# Altium project AD9959-PRJ.PrjPcb
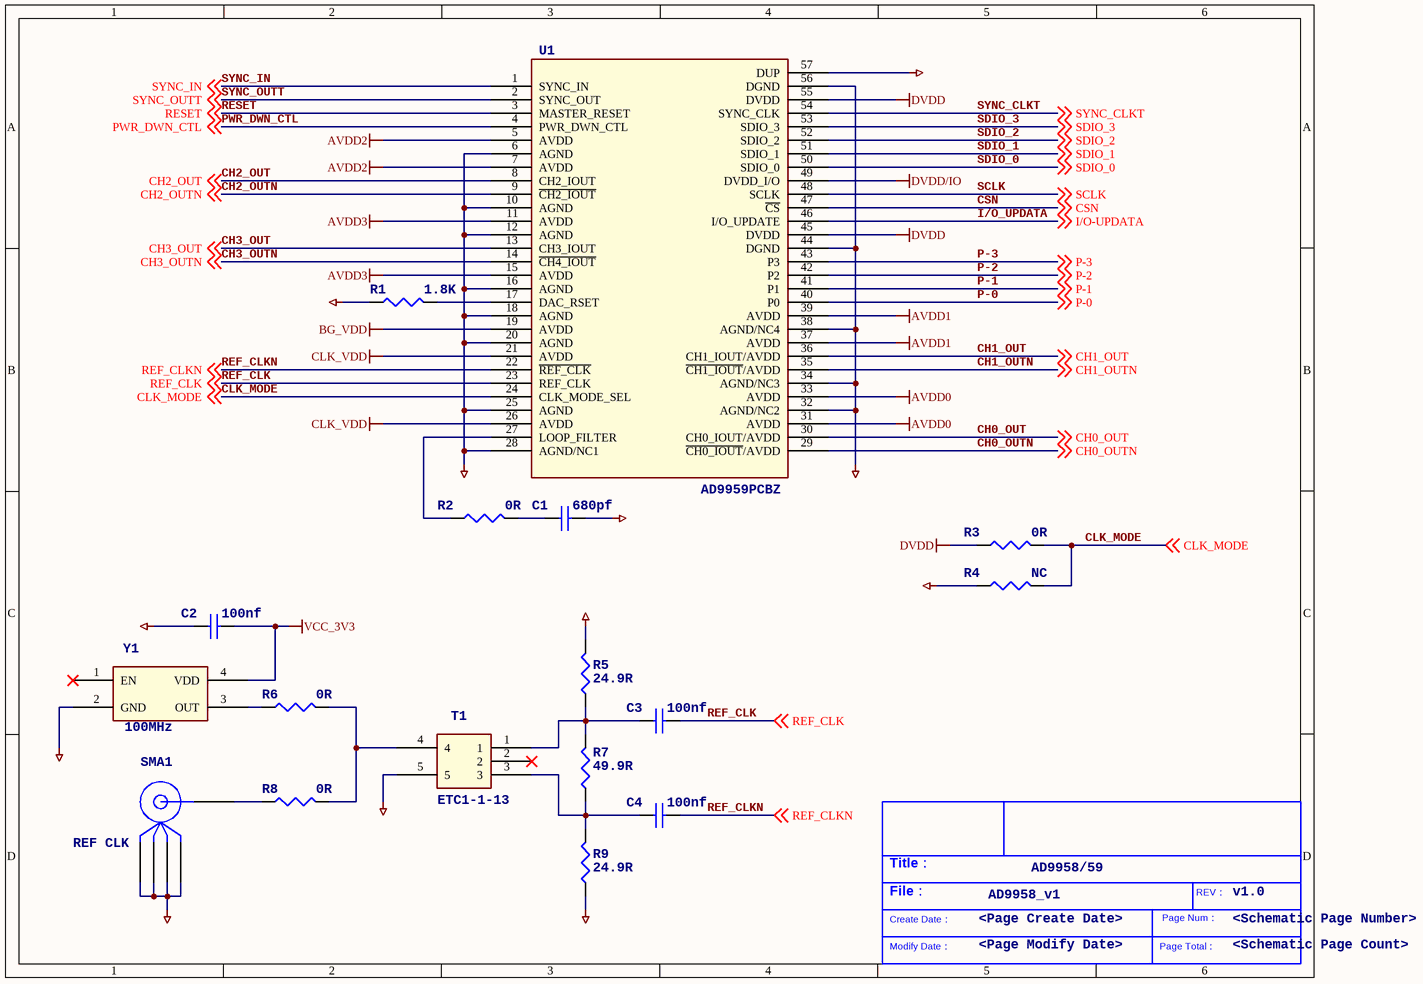
[diagram p0: 01-MCU.SchDoc]
4 sheets, 148 parts. Net scope: global (net labels, ports and power ports of the same name join across sheets).
Board file: AD9959-pcb.PcbDoc
Sheets:
  01-MCU.SchDoc
  02-I_O.SchDoc
  03-LP Filter.SchDoc
  04-POWER.SchDoc

## Sheet 01-MCU.SchDoc
size 246 x 182 mm

### Parts
(Parts that share a designator on the sheet are numbered #1, #2 ... from top to bottom, then left to right.)
*#1  Schematic Page Count: <Schematic Page Count>  Schematic Page Number: <Schematic Page Number>  Page Modify Date: <Page Modify Date>  Page Create Date: <Page Create Date>  Revcode: v1.0  File: AD9958_v1  Title: AD9958/59  (hidden comment: My_Title_Block)  (graphical)
C1  680pf  [0603C]
C2  100nf  [0603C]
C3  100nf  [0603C]
C4  100nf  [0603C]
R1  1.8K  [0603R]
R2  0R  [0603R]
R3  0R  [0603R]
R4  NC  [0603R]
R5  24.9R  [0603R]
R6  0R  [0603R]
R7  49.9R  [0603R]
R8  0R  [0603R]
R9  24.9R  [0603R]
SMA1  REF CLK  [CON10-5R1X5R1]
T1  ETC1-1-13  [SM-22]
U1  AD9959PCBZ  [QFN50P800X800X100-56M]
Y1  100MHz  [XTAL-SMD-7050_4P]

### Nets
AGND: C1.2 C2.1 R1.1 R4.1 R5.2 R9.1 SMA1.2(GND) SMA1.3(GND) SMA1.4(GND) SMA1.5(GND) T1.5 U1.6(AGND) U1.10(AGND) U1.12(AGND) U1.16(AGND) U1.18(AGND) U1.20(AGND) U1.25(AGND) U1.28(AGND/NC1) U1.32(AGND/NC2) U1.34(AGND/NC3) U1.38(AGND/NC4) U1.44(DGND) U1.56(DGND) U1.57(DUP) Y1.2(GND)
AVDD0: U1.31(AVDD) U1.33(AVDD)
AVDD1: U1.37(AVDD) U1.39(AVDD)
AVDD2: U1.5(AVDD) U1.7(AVDD)
AVDD3: U1.11(AVDD) U1.15(AVDD)
BG_VDD: U1.19(AVDD)
CLK_VDD: U1.21(AVDD) U1.26(AVDD)
DVDD: R3.1 U1.45(DVDD) U1.55(DVDD)
DVDD/IO: U1.49(DVDD_I/O)
VCC_3V3: C2.2 Y1.4(VDD)
CH0_OUT: U1.30(CH0_IOUT/AVDD) ; off-sheet CH0_OUT
CH0_OUTN: U1.29(~{CH0_IOUT}/AVDD) ; off-sheet CH0_OUTN
CH1_OUT: U1.36(CH1_IOUT/AVDD) ; off-sheet CH1_OUT
CH1_OUTN: U1.35(~{CH1_IOUT}/AVDD) ; off-sheet CH1_OUTN
CH2_OUT: U1.8(CH2_IOUT) ; off-sheet CH2_OUT
CH2_OUTN: U1.9(~{CH2_IOUT}) ; off-sheet CH2_OUTN
CH3_OUT: U1.13(CH3_IOUT) ; off-sheet CH3_OUT
CH3_OUTN: U1.14(~{CH4_IOUT}) ; off-sheet CH3_OUTN
CLK_MODE: R3.2 R4.2 U1.24(CLK_MODE_SEL) ; off-sheet CLK_MODE
CSN: U1.47(~{CS}) ; off-sheet CSN
I/O-UPDATA: U1.46(I/O_UPDATE) ; off-sheet I/O-UPDATA  [also labelled I/O_UPDATA]
P-0: U1.40(P0) ; off-sheet P-0
P-1: U1.41(P1) ; off-sheet P-1
P-2: U1.42(P2) ; off-sheet P-2
P-3: U1.43(P3) ; off-sheet P-3
PWR_DWN_CTL: U1.4(PWR_DWN_CTL) ; off-sheet PWR_DWN_CTL
REF_CLK: C3.2 U1.23(REF_CLK) ; off-sheet REF_CLK
REF_CLKN: C4.2 U1.22(~{REF_CLK}) ; off-sheet REF_CLKN
RESET: U1.3(MASTER_RESET) ; off-sheet RESET
SCLK: U1.48(SCLK) ; off-sheet SCLK
SDIO_0: U1.50(SDIO_0) ; off-sheet SDIO_0
SDIO_1: U1.51(SDIO_1) ; off-sheet SDIO_1
SDIO_2: U1.52(SDIO_2) ; off-sheet SDIO_2
SDIO_3: U1.53(SDIO_3) ; off-sheet SDIO_3
SYNC_CLKT: U1.54(SYNC_CLK) ; off-sheet SYNC_CLKT
SYNC_IN: U1.1(SYNC_IN) ; off-sheet SYNC_IN
SYNC_OUTT: U1.2(SYNC_OUT) ; off-sheet SYNC_OUTT
NetC1_1: C1.1 R2.2
NetC3_1: C3.1 R5.1 R7.2 T1.1
NetC4_1: C4.1 R7.1 R9.2 T1.3
NetR1_2: R1.2 U1.17(DAC_RSET)
NetR2_1: R2.1 U1.27(LOOP_FILTER)
NetR6_1: R6.1 Y1.3(OUT)
NetR6_2: R6.2 R8.2 T1.4
NetR8_1: R8.1 SMA1.1

Not connected (* = marked no-connect by the designer): T1 2*; Y1 1(EN)*

### Notes on the sheet
- (in symbol My_Title_Block) Title：; REV：; File：; Create Date：; Page Num：; Modify Date：; Page Total：

### Library data of the parts
*#1 = My_Title_Block: Company Name: 东莞理工学院; Page Count: 4; Page Number: 1
C1-C4 = CAP NP
R1-R9 = R
SMA1 = BNC
U1 = AD9958BCPZ_2
Y1 = XTAL_SMD

## Sheet 02-I_O.SchDoc
size 246 x 182 mm
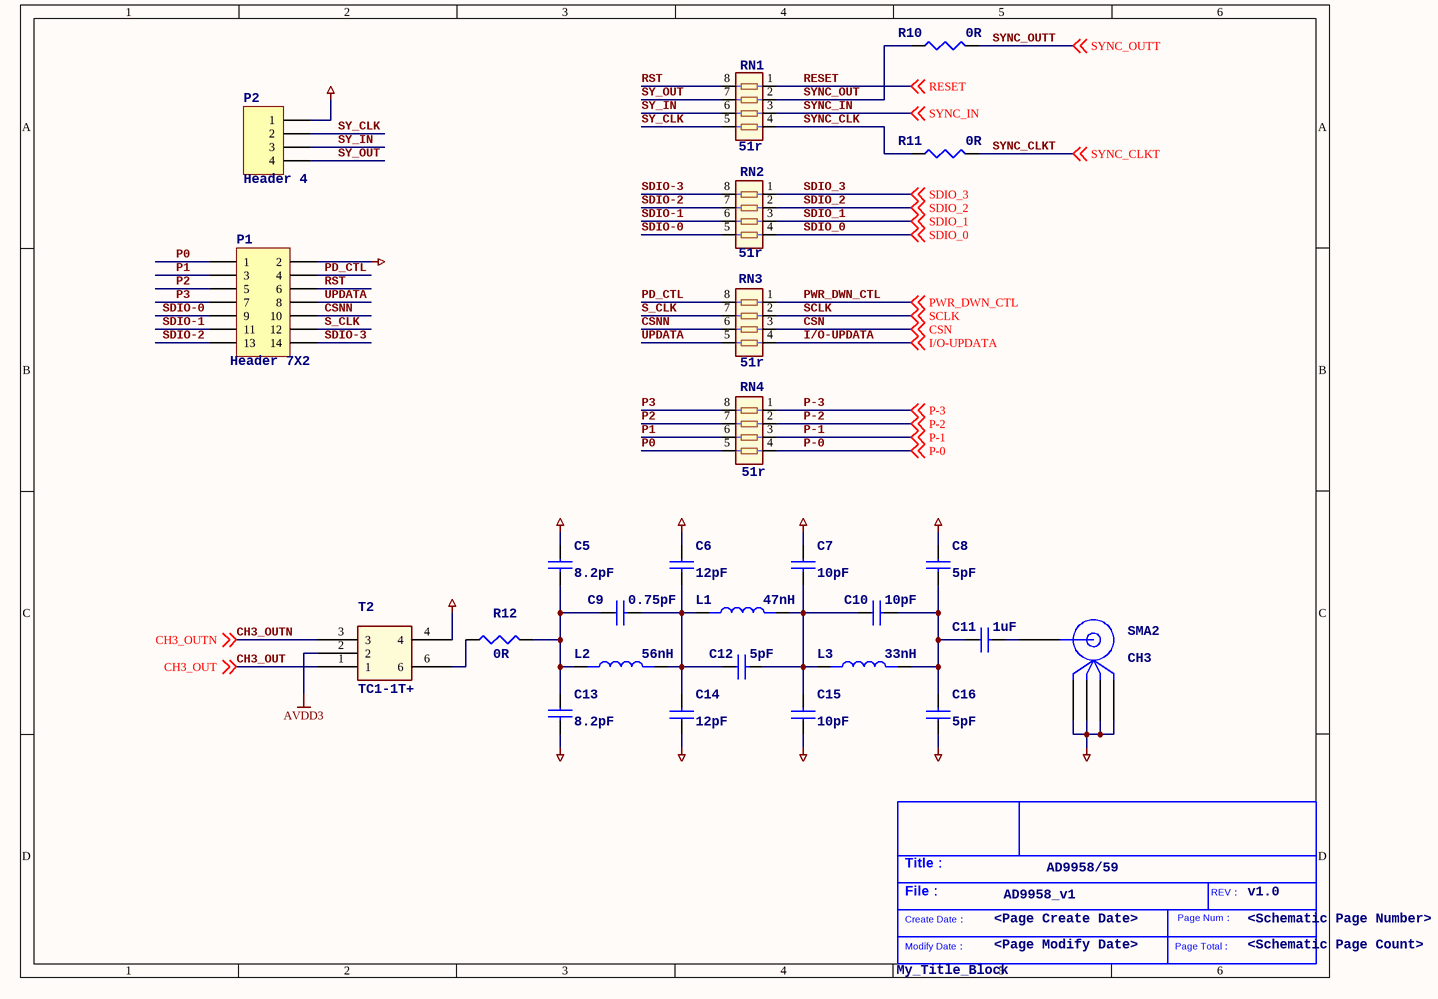
[diagram p1: 02-I_O.SchDoc]

### Parts
(Parts that share a designator on the sheet are numbered #1, #2 ... from top to bottom, then left to right.)
*#2  My_Title_Block  Schematic Page Count: <Schematic Page Count>  Schematic Page Number: <Schematic Page Number>  Page Modify Date: <Page Modify Date>  Page Create Date: <Page Create Date>  Revcode: v1.0  File: AD9958_v1  Title: AD9958/59  (graphical)
C5  8.2pF  [0603C]
C6  12pF  [0603C]
C7  10pF  [0603C]
C8  5pF  [0603C]
C9  0.75pF  [0603C]
C10  10pF  [0603C]
C11  1uF  [0603C]
C12  5pF  [0603C]
C13  8.2pF  [0603C]
C14  12pF  [0603C]
C15  10pF  [0603C]
C16  5pF  [0603C]
L1  47nH  [0603L]
L2  56nH  [0603L]
L3  33nH  [0603L]
P1  Header 7X2  [CON20VP2R54-2X7TM-1]
P2  Header 4  [HDR1X4]
R10  0R  [0603R]
R11  0R  [0603R]
R12  0R  [0603R]
RN1  51r  [0603RA]
RN2  51r  [0603RA]
RN3  51r  [0603RA]
RN4  51r  [0603RA]
SMA2  CH3  [SMA-SMD]
T2  TC1-1T+  [at224-1a]

### Nets
AGND: C5.1 C6.1 C7.1 C8.1 C13.2 C14.1 C15.1 C16.1 P1.2 P2.1 SMA2.2(GND) SMA2.3(GND) SMA2.4(GND) SMA2.5(GND) T2.4
AVDD3: T2.2
CH3_OUT: T2.1 ; off-sheet CH3_OUT
CH3_OUTN: T2.3 ; off-sheet CH3_OUTN
CSN: RN3.3 ; off-sheet CSN
CSNN: P1.10 RN3.6
I/O-UPDATA: RN3.4 ; off-sheet I/O-UPDATA
P0: P1.1 RN4.5
P1: P1.3 RN4.6
P2: P1.5 RN4.7
P3: P1.7 RN4.8
P-0: RN4.4 ; off-sheet P-0
P-1: RN4.3 ; off-sheet P-1
P-2: RN4.2 ; off-sheet P-2
P-3: RN4.1 ; off-sheet P-3
PD_CTL: P1.4 RN3.8
PWR_DWN_CTL: RN3.1 ; off-sheet PWR_DWN_CTL
RESET: RN1.1 ; off-sheet RESET
RST: P1.6 RN1.8
S_CLK: P1.12 RN3.7
SCLK: RN3.2 ; off-sheet SCLK
SDIO-0: P1.9 RN2.5
SDIO-1: P1.11 RN2.6
SDIO-2: P1.13 RN2.7
SDIO-3: P1.14 RN2.8
SDIO_0: RN2.4 ; off-sheet SDIO_0
SDIO_1: RN2.3 ; off-sheet SDIO_1
SDIO_2: RN2.2 ; off-sheet SDIO_2
SDIO_3: RN2.1 ; off-sheet SDIO_3
SY_CLK: P2.2 RN1.5
SY_IN: P2.3 RN1.6
SY_OUT: P2.4 RN1.7
SYNC_CLK: R11.1 RN1.4
SYNC_CLKT: R11.2 ; off-sheet SYNC_CLKT
SYNC_IN: RN1.3 ; off-sheet SYNC_IN
SYNC_OUT: R10.1 RN1.2
SYNC_OUTT: R10.2 ; off-sheet SYNC_OUTT
UPDATA: P1.8 RN3.5
NetC5_2: C5.2 C9.1 C13.1 L2.1 R12.2
NetC6_2: C6.2 C9.2 C12.1 C14.2 L1.1 L2.2
NetC7_2: C7.2 C10.1 C12.2 C15.2 L1.2 L3.1
NetC8_2: C8.2 C10.2 C11.1 C16.2 L3.2
NetC11_2: C11.2 SMA2.1
NetR12_1: R12.1 T2.6

### Notes on the sheet
- (in symbol My_Title_Block) Title：; REV：; File：; Create Date：; Page Num：; Modify Date：; Page Total：

### Library data of the parts
C5-C16 = CAP NP
L1-L3 = INDUCTANCE
P1 = Header 7X2: Header, 7-Pin, Dual row; LatestRevisionDate: 17-Jul-2002; LatestRevisionNote: Re-released for DXP Platform.; Publisher: Altium Limited
P2 = Header 4: Header, 4-Pin; LatestRevisionDate: 17-Jul-2002; LatestRevisionNote: Re-released for DXP Platform.; Publisher: Altium Limited
R10-R12 = R
RN1-RN4 = R_PACK_4
SMA2 = BNC

## Sheet 03-LP Filter.SchDoc
size 246 x 182 mm
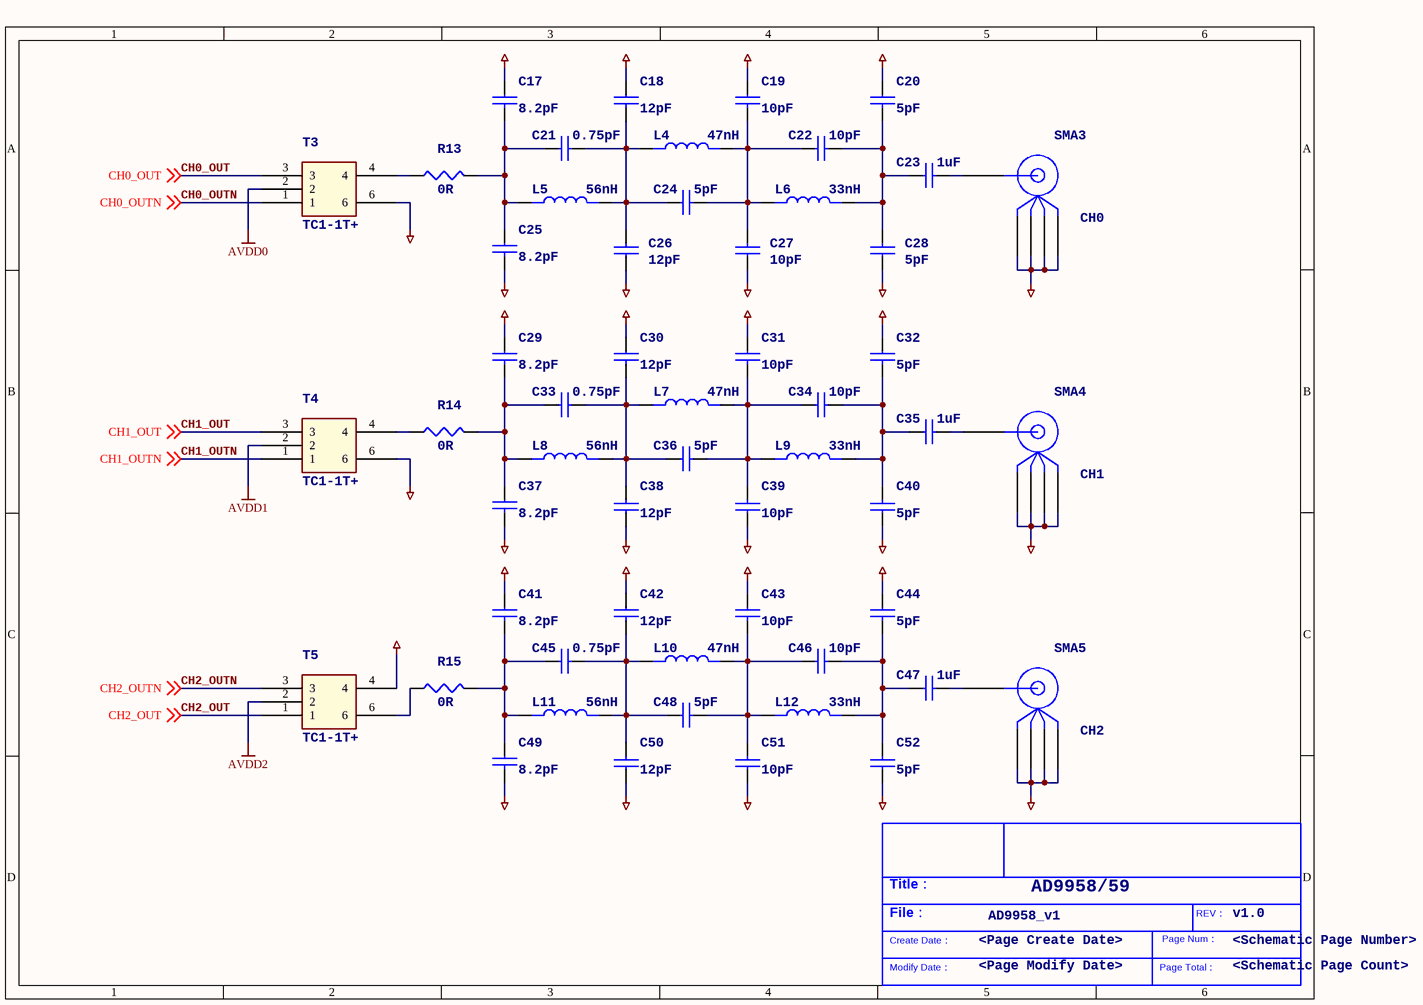
[diagram p2: 03-LP Filter.SchDoc]

### Parts
(Parts that share a designator on the sheet are numbered #1, #2 ... from top to bottom, then left to right.)
*#3  Schematic Page Count: <Schematic Page Count>  Schematic Page Number: <Schematic Page Number>  Page Modify Date: <Page Modify Date>  Page Create Date: <Page Create Date>  Revcode: v1.0  File: AD9958_v1  Title: AD9958/59  (hidden comment: My_Title_Block)  (graphical)
C17  8.2pF  [0603C]
C18  12pF  [0603C]
C19  10pF  [0603C]
C20  5pF  [0603C]
C21  0.75pF  [0603C]
C22  10pF  [0603C]
C23  1uF  [0603C]
C24  5pF  [0603C]
C25  8.2pF  [0603C]
C26  12pF  [0603C]
C27  10pF  [0603C]
C28  5pF  [0603C]
C29  8.2pF  [0603C]
C30  12pF  [0603C]
C31  10pF  [0603C]
C32  5pF  [0603C]
C33  0.75pF  [0603C]
C34  10pF  [0603C]
C35  1uF  [0603C]
C36  5pF  [0603C]
C37  8.2pF  [0603C]
C38  12pF  [0603C]
C39  10pF  [0603C]
C40  5pF  [0603C]
C41  8.2pF  [0603C]
C42  12pF  [0603C]
C43  10pF  [0603C]
C44  5pF  [0603C]
C45  0.75pF  [0603C]
C46  10pF  [0603C]
C47  1uF  [0603C]
C48  5pF  [0603C]
C49  8.2pF  [0603C]
C50  12pF  [0603C]
C51  10pF  [0603C]
C52  5pF  [0603C]
L4  47nH  [0603L]
L5  56nH  [0603L]
L6  33nH  [0603L]
L7  47nH  [0603L]
L8  56nH  [0603L]
L9  33nH  [0603L]
L10  47nH  [0603L]
L11  56nH  [0603L]
L12  33nH  [0603L]
R13  0R  [0603R]
R14  0R  [0603R]
R15  0R  [0603R]
SMA3  CH0  [SMA-SMD]
SMA4  CH1  [SMA-SMD]
SMA5  CH2  [SMA-SMD]
T3  TC1-1T+  [at224-1a]
T4  TC1-1T+  [at224-1a]
T5  TC1-1T+  [at224-1a]

### Nets
AGND: C17.1 C18.1 C19.1 C20.1 C25.2 C26.1 C27.1 C28.1 C29.1 C30.1 C31.1 C32.1 C37.2 C38.1 C39.1 C40.1 C41.1 C42.1 C43.1 C44.1 C49.2 C50.1 C51.1 C52.1 SMA3.2(GND) SMA3.3(GND) SMA3.4(GND) SMA3.5(GND) SMA4.2(GND) SMA4.3(GND) SMA4.4(GND) SMA4.5(GND) SMA5.2(GND) SMA5.3(GND) SMA5.4(GND) SMA5.5(GND) T3.6 T4.6 T5.4
AVDD0: T3.2
AVDD1: T4.2
AVDD2: T5.2
CH0_OUT: T3.3 ; off-sheet CH0_OUT
CH0_OUTN: T3.1 ; off-sheet CH0_OUTN
CH1_OUT: T4.3 ; off-sheet CH1_OUT
CH1_OUTN: T4.1 ; off-sheet CH1_OUTN
CH2_OUT: T5.1 ; off-sheet CH2_OUT
CH2_OUTN: T5.3 ; off-sheet CH2_OUTN
NetC17_2: C17.2 C21.1 C25.1 L5.1 R13.2
NetC18_2: C18.2 C21.2 C24.1 C26.2 L4.1 L5.2
NetC19_2: C19.2 C22.1 C24.2 C27.2 L4.2 L6.1
NetC20_2: C20.2 C22.2 C23.1 C28.2 L6.2
NetC23_2: C23.2 SMA3.1
NetC29_2: C29.2 C33.1 C37.1 L8.1 R14.2
NetC30_2: C30.2 C33.2 C36.1 C38.2 L7.1 L8.2
NetC31_2: C31.2 C34.1 C36.2 C39.2 L7.2 L9.1
NetC32_2: C32.2 C34.2 C35.1 C40.2 L9.2
NetC35_2: C35.2 SMA4.1
NetC41_2: C41.2 C45.1 C49.1 L11.1 R15.2
NetC42_2: C42.2 C45.2 C48.1 C50.2 L10.1 L11.2
NetC43_2: C43.2 C46.1 C48.2 C51.2 L10.2 L12.1
NetC44_2: C44.2 C46.2 C47.1 C52.2 L12.2
NetC47_2: C47.2 SMA5.1
NetR13_1: R13.1 T3.4
NetR14_1: R14.1 T4.4
NetR15_1: R15.1 T5.6

### Notes on the sheet
- (in symbol My_Title_Block) Title：; REV：; File：; Create Date：; Page Num：; Modify Date：; Page Total：

### Library data of the parts
*#3 = My_Title_Block: Company Name: 东莞理工学院; Page Count: 4; Page Number: 3
C17-C52 = CAP NP
L4-L12 = INDUCTANCE
R13-R15 = R
SMA3-SMA5 = BNC

## Sheet 04-POWER.SchDoc
size 246 x 182 mm
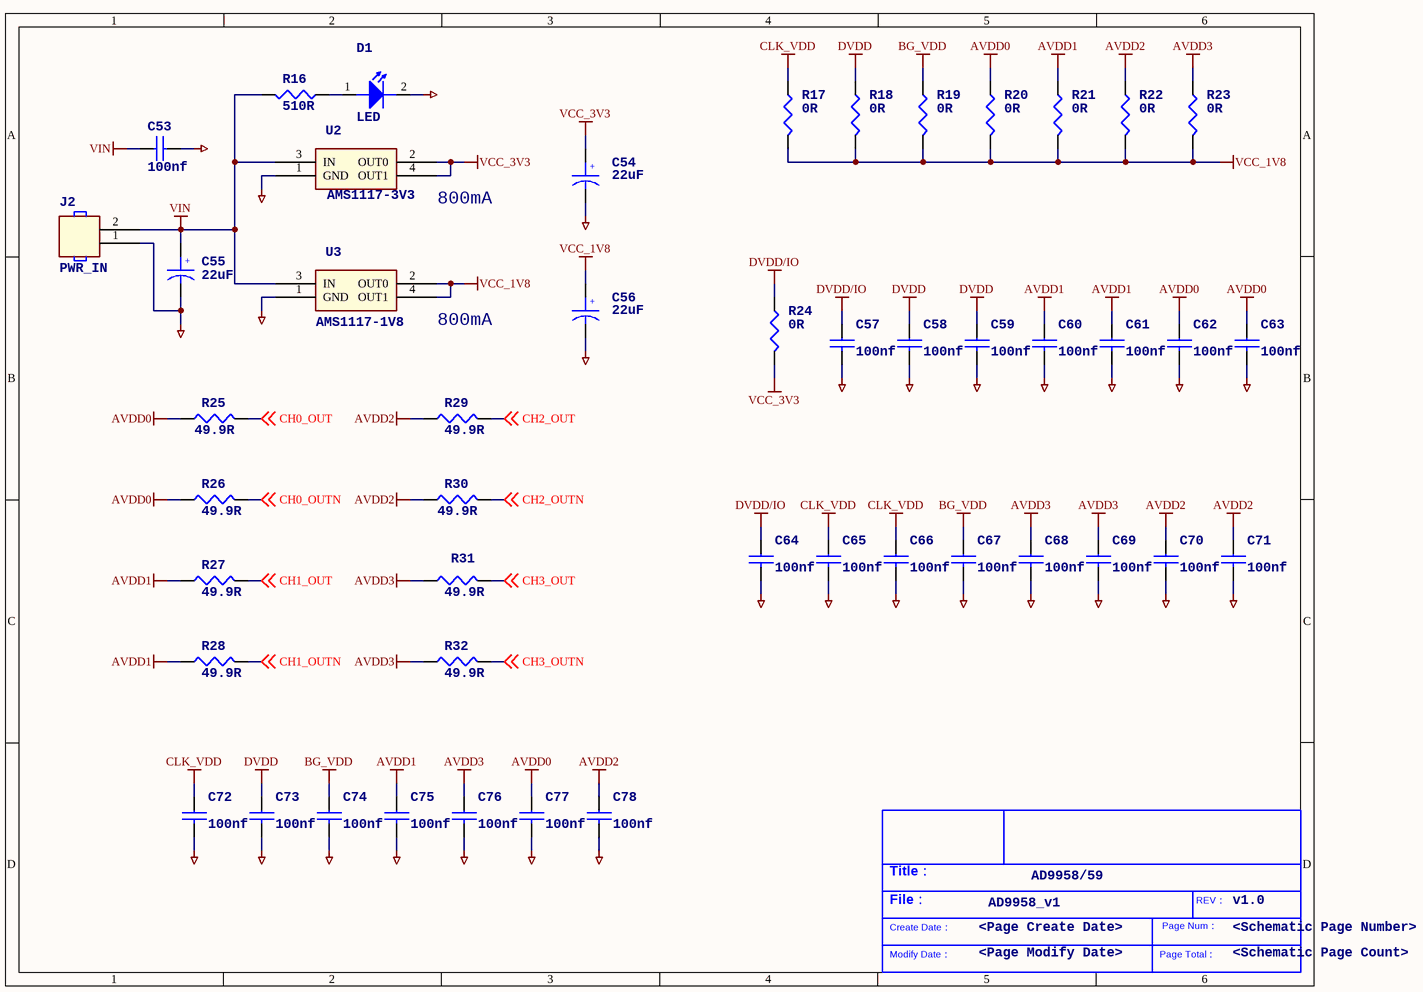
[diagram p3: 04-POWER.SchDoc]

### Parts
(Parts that share a designator on the sheet are numbered #1, #2 ... from top to bottom, then left to right.)
*#4  Schematic Page Count: <Schematic Page Count>  Schematic Page Number: <Schematic Page Number>  Page Modify Date: <Page Modify Date>  Page Create Date: <Page Create Date>  Revcode: v1.0  File: AD9958_v1  Title: AD9958/59  (hidden comment: My_Title_Block)  (graphical)
C53  100nf  [0603C]
C54  22uF  [1206T]
C55  22uF  [1206T]
C56  22uF  [1206T]
C57  100nf  [0603C]
C58  100nf  [0603C]
C59  100nf  [0603C]
C60  100nf  [0603C]
C61  100nf  [0603C]
C62  100nf  [0603C]
C63  100nf  [0603C]
C64  100nf  [0603C]
C65  100nf  [0603C]
C66  100nf  [0603C]
C67  100nf  [0603C]
C68  100nf  [0603C]
C69  100nf  [0603C]
C70  100nf  [0603C]
C71  100nf  [0603C]
C72  100nf  [0603C]
C73  100nf  [0603C]
C74  100nf  [0603C]
C75  100nf  [0603C]
C76  100nf  [0603C]
C77  100nf  [0603C]
C78  100nf  [0603C]
D1  LED  [0603D]
J2  PWR_IN  [KF2EDG_3R81_2P]
R16  510R  [0603R]
R17  0R  [0603R]
R18  0R  [0603R]
R19  0R  [0603R]
R20  0R  [0603R]
R21  0R  [0603R]
R22  0R  [0603R]
R23  0R  [0603R]
R24  0R  [0603R]
R25  49.9R  [0603R]
R26  49.9R  [0603R]
R27  49.9R  [0603R]
R28  49.9R  [0603R]
R29  49.9R  [0603R]
R30  49.9R  [0603R]
R31  49.9R  [0603R]
R32  49.9R  [0603R]
U2  AMS1117-3V3  [SOT223]
U3  AMS1117-1V8  [SOT223]

### Nets
AGND: C53.2 C54.2 C55.2 C56.2 C57.2 C58.2 C59.2 C60.2 C61.2 C62.2 C63.2 C64.2 C65.2 C66.2 C67.2 C68.2 C69.2 C70.2 C71.2 C72.2 C73.2 C74.2 C75.2 C76.2 C77.2 C78.2 D1.2(K) J2.1 U2.1(GND) U3.1(GND)
AVDD0: C62.1 C63.1 C77.1 R20.1 R25.1 R26.1
AVDD1: C60.1 C61.1 C75.1 R21.1 R27.1 R28.1
AVDD2: C70.1 C71.1 C78.1 R22.1 R29.1 R30.1
AVDD3: C68.1 C69.1 C76.1 R23.1 R31.1 R32.1
BG_VDD: C67.1 C74.1 R19.1
CLK_VDD: C65.1 C66.1 C72.1 R17.1
DVDD: C58.1 C59.1 C73.1 R18.1
DVDD/IO: C57.1 C64.1 R24.1
VCC_1V8: C56.1 R17.2 R18.2 R19.2 R20.2 R21.2 R22.2 R23.2 U3.2(OUT0) U3.4(OUT1)
VCC_3V3: C54.1 R24.2 U2.2(OUT0) U2.4(OUT1)
VIN: C53.1 C55.1 J2.2 R16.2 U2.3(IN) U3.3(IN)
CH0_OUT: R25.2 ; off-sheet CH0_OUT
CH0_OUTN: R26.2 ; off-sheet CH0_OUTN
CH1_OUT: R27.2 ; off-sheet CH1_OUT
CH1_OUTN: R28.2 ; off-sheet CH1_OUTN
CH2_OUT: R29.2 ; off-sheet CH2_OUT
CH2_OUTN: R30.2 ; off-sheet CH2_OUTN
CH3_OUT: R31.2 ; off-sheet CH3_OUT
CH3_OUTN: R32.2 ; off-sheet CH3_OUTN
NetD1_1: D1.1(A) R16.1

### Notes on the sheet
- (near U2) 800mA
- (near U3) 800mA
- (in symbol CAP POL) +
- (in symbol My_Title_Block) Title：; REV：; File：; Create Date：; Page Num：; Modify Date：; Page Total：

### Library data of the parts
*#4 = My_Title_Block: Company Name: 东莞理工学院; Page Count: 4; Page Number: 4
C53 C57-C78 = CAP NP
C54-C56 = CAP POL
D1 = LED: pin to pad: 1>2 2>1
J2 = HEADER 2
R16-R32 = R
U3 = AMS1117-3V3

## Nets that join several sheets
AGND: 01-MCU (26 pins), 02-I_O (15 pins), 03-LP Filter (39 pins), 04-POWER (30 pins)
AVDD0: 01-MCU (U1.31 U1.33), 03-LP Filter (T3.2), 04-POWER (6 pins)
AVDD1: 01-MCU (U1.37 U1.39), 03-LP Filter (T4.2), 04-POWER (6 pins)
AVDD2: 01-MCU (U1.5 U1.7), 03-LP Filter (T5.2), 04-POWER (6 pins)
AVDD3: 01-MCU (U1.11 U1.15), 02-I_O (T2.2), 04-POWER (6 pins)
BG_VDD: 01-MCU (U1.19), 04-POWER (C67.1 C74.1 R19.1)
CLK_VDD: 01-MCU (U1.21 U1.26), 04-POWER (C65.1 C66.1 C72.1 R17.1)
DVDD: 01-MCU (R3.1 U1.45 U1.55), 04-POWER (C58.1 C59.1 C73.1 R18.1)
DVDD/IO: 01-MCU (U1.49), 04-POWER (C57.1 C64.1 R24.1)
VCC_3V3: 01-MCU (C2.2 Y1.4), 04-POWER (C54.1 R24.2 U2.2 U2.4)
CH0_OUT: 01-MCU (U1.30), 03-LP Filter (T3.3), 04-POWER (R25.2)
CH0_OUTN: 01-MCU (U1.29), 03-LP Filter (T3.1), 04-POWER (R26.2)
CH1_OUT: 01-MCU (U1.36), 03-LP Filter (T4.3), 04-POWER (R27.2)
CH1_OUTN: 01-MCU (U1.35), 03-LP Filter (T4.1), 04-POWER (R28.2)
CH2_OUT: 01-MCU (U1.8), 03-LP Filter (T5.1), 04-POWER (R29.2)
CH2_OUTN: 01-MCU (U1.9), 03-LP Filter (T5.3), 04-POWER (R30.2)
CH3_OUT: 01-MCU (U1.13), 02-I_O (T2.1), 04-POWER (R31.2)
CH3_OUTN: 01-MCU (U1.14), 02-I_O (T2.3), 04-POWER (R32.2)
CSN: 01-MCU (U1.47), 02-I_O (RN3.3)
I/O-UPDATA: 01-MCU (U1.46), 02-I_O (RN3.4)
P-0: 01-MCU (U1.40), 02-I_O (RN4.4)
P-1: 01-MCU (U1.41), 02-I_O (RN4.3)
P-2: 01-MCU (U1.42), 02-I_O (RN4.2)
P-3: 01-MCU (U1.43), 02-I_O (RN4.1)
PWR_DWN_CTL: 01-MCU (U1.4), 02-I_O (RN3.1)
RESET: 01-MCU (U1.3), 02-I_O (RN1.1)
SCLK: 01-MCU (U1.48), 02-I_O (RN3.2)
SDIO_0: 01-MCU (U1.50), 02-I_O (RN2.4)
SDIO_1: 01-MCU (U1.51), 02-I_O (RN2.3)
SDIO_2: 01-MCU (U1.52), 02-I_O (RN2.2)
SDIO_3: 01-MCU (U1.53), 02-I_O (RN2.1)
SYNC_CLKT: 01-MCU (U1.54), 02-I_O (R11.2)
SYNC_IN: 01-MCU (U1.1), 02-I_O (RN1.3)
SYNC_OUTT: 01-MCU (U1.2), 02-I_O (R10.2)